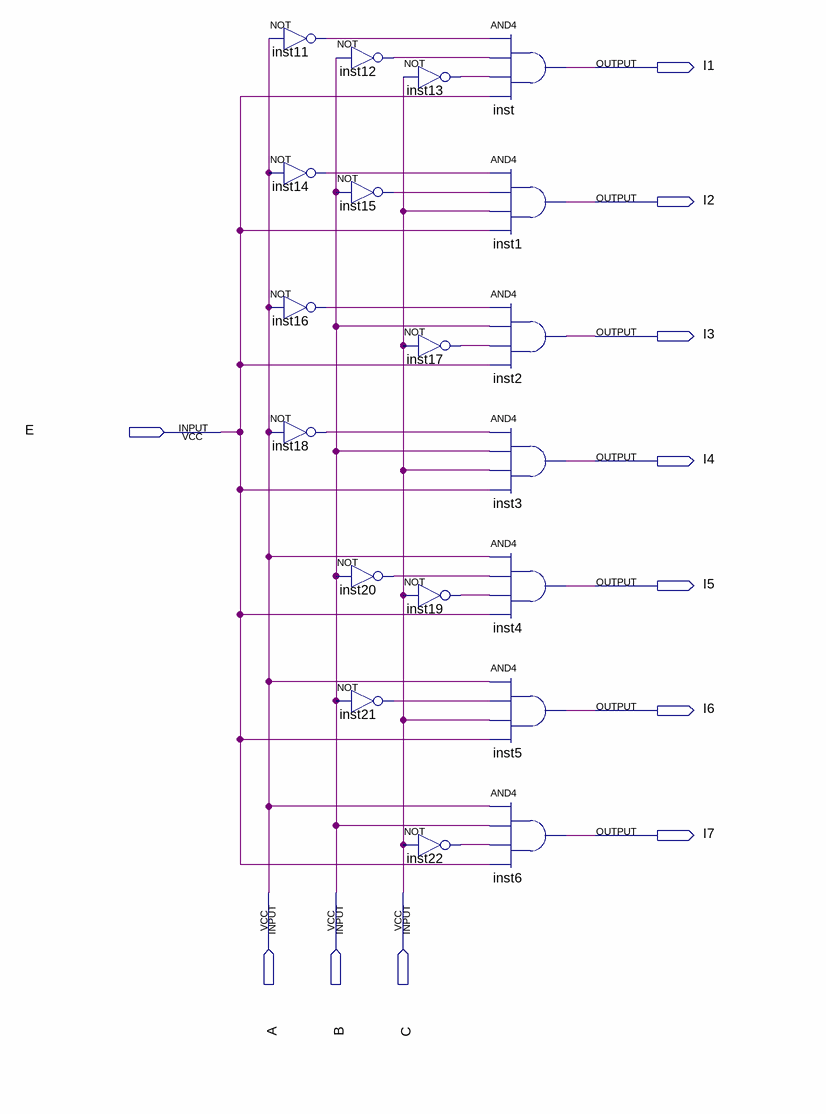
[diagram p0: schematic sheet]
// Quartus schematic Deliciaplex.bdf as structural Verilog: 19 symbols, 11 pins
module Deliciaplex (
  input  E,
  input  A,
  input  B,
  input  C,
  output I1,
  output I2,
  output I3,
  output I4,
  output I5,
  output I6,
  output I7
);

  wire inst11_out, inst12_out, inst13_out, inst14_out, inst15_out, inst16_out, inst17_out, inst18_out,
       inst19_out, inst20_out, inst21_out, inst22_out;

  not inst11 (inst11_out, A);
  not inst14 (inst14_out, A);
  not inst16 (inst16_out, A);
  not inst18 (inst18_out, A);
  not inst12 (inst12_out, B);
  not inst15 (inst15_out, B);
  not inst20 (inst20_out, B);
  not inst21 (inst21_out, B);
  not inst13 (inst13_out, C);
  not inst17 (inst17_out, C);
  not inst19 (inst19_out, C);
  not inst22 (inst22_out, C);
  and inst (I1, inst11_out, inst12_out, inst13_out, E);
  and inst1 (I2, inst14_out, inst15_out, C, E);
  and inst2 (I3, inst16_out, B, inst17_out, E);
  and inst3 (I4, inst18_out, B, C, E);
  and inst4 (I5, A, inst20_out, inst19_out, E);
  and inst5 (I6, A, inst21_out, C, E);
  and inst6 (I7, A, B, inst22_out, E);
endmodule
